# Altium project zPovBirthday.PrjPcb
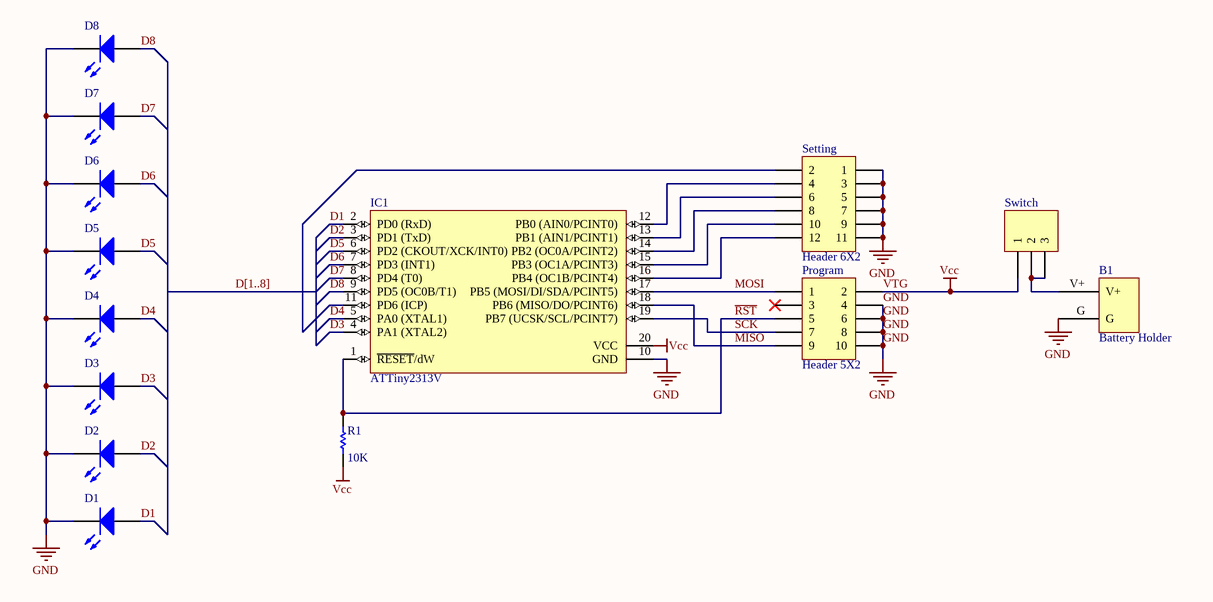
[diagram p0: main.SchDoc]
1 sheet, 14 parts. Net scope: global (net labels, ports and power ports of the same name join across sheets).

## Sheet main.SchDoc: POV
size A4

### Parts
B1  Battery Holder  [Battery Holder]
D1  LED1  [Led5mm]  (value not drawn)
D2  LED1  [Led5mm]  (value not drawn)
D3  LED1  [Led5mm]  (value not drawn)
D4  LED1  [Led5mm]  (value not drawn)
D5  LED1  [Led5mm]  (value not drawn)
D6  LED1  [Led5mm]  (value not drawn)
D7  LED1  [Led5mm]  (value not drawn)
D8  LED1  [Led5mm]  (value not drawn)
IC1  ATTiny2313V  [20P3]
Program  Header 5X2  [Box2x5]
R1  value 10K  [AXIAL-0.3]  (hidden comment: Res1)
Setting  Header 6X2  [DIP6SWITCH]
Switch  Header 3  [HDR1X3]  (value not drawn)

### Nets
GND: B1.G D1.2(K) D2.2(K) D3.2(K) D4.2(K) D5.2(K) D6.2(K) D7.2(K) D8.2(K) IC1.10(GND) Program.4 Program.6 Program.8 Program.10 Setting.1 Setting.3 Setting.5 Setting.7 Setting.9 Setting.11
VTG: IC1.20(VCC) Program.2 R1.1 Switch.1  [also labelled Vcc]
D1: D1.1(A) IC1.2(PD0_(RxD))
D2: D2.1(A) IC1.3(PD1_(TxD))
D3: D3.1(A) IC1.4(PA1_(XTAL2))
D4: D4.1(A) IC1.5(PA0_(XTAL1))
D5: D5.1(A) IC1.6(PD2_(CKOUT/XCK/INT0))
D6: D6.1(A) IC1.7(PD3_(INT1))
D7: D7.1(A) IC1.8(PD4_(T0))
D8: D8.1(A) IC1.9(PD5_(OC0B/T1))
MISO: IC1.18(PB6_(MISO/DO/PCINT6)) Program.9
MOSI: IC1.17(PB5_(MOSI/DI/SDA/PCINT5)) Program.1
~{RST}: IC1.1(~{RESET}/dW) Program.5 R1.2
SCK: IC1.19(PB7_(UCSK/SCL/PCINT7)) Program.7
NetB1_V+: B1.V+ Switch.2 Switch.3
NetIC1_11: IC1.11(PD6_(ICP)) Setting.2
NetIC1_12: IC1.12(PB0_(AIN0/PCINT0)) Setting.4
NetIC1_13: IC1.13(PB1_(AIN1/PCINT1)) Setting.6
NetIC1_14: IC1.14(PB2_(OC0A/PCINT2)) Setting.8
NetIC1_15: IC1.15(PB3_(OC1A/PCINT3)) Setting.10
NetIC1_16: IC1.16(PB4_(OC1B/PCINT4)) Setting.12

Not connected (* = marked no-connect by the designer): Program 3*

### Buses and harness runs
bus D[1..8]

### Library data of the parts
D1-D8 = LED1: Typical RED GaAs LED; Published: 8-Jun-2000; LatestRevisionDate: 08-Jul-2005; LatestRevisionNote: Mech Layer 1 removed.; PackageReference: LED-1; Publisher: Altium Limited
IC1 = ATtiny2313V-PI: 8-Bit AVR Microcontroller with 2K Bytes of Flash Memory; Published: 17-Sep-2003; LatestRevisionDate: 04-Mar-2005; LatestRevisionNote: Stylized 3D Model Added.; DatasheetVersion: 1477C-AVR-09/02; PackageVersion: Aug-1999; PackageReference: 20P3; Publisher: Altium Limited; PackageDescription: DIP; 20 Leads; Row Spacing 7.62 mm; Pitch 2.54 mm; Code_JEDEC: MS-001-AD; ComponentLink1Description: Manufacturer Link; ComponentLink1URL: http://www.atmel.com; ComponentLink2Description: Datasheet; ComponentLink2URL: http://www.atmel.com/dyn/resources/prod_documents/doc1477.pdf
Program = Header 5X2: Header, 5-Pin, Dual row; LatestRevisionDate: 17-Jul-2002; LatestRevisionNote: Re-released for DXP Platform.; Publisher: Altium Limited
R1 = Res1: Resistor; Published: 8-Jun-2000; LatestRevisionDate: 17-Jul-2002; LatestRevisionNote: Re-released for DXP Platform.; PackageReference: AXIAL-0.3; Publisher: Altium Limited
Setting = Header 6X2: Header, 6-Pin, Dual row; LatestRevisionDate: 17-Jul-2002; LatestRevisionNote: Re-released for DXP Platform.; Publisher: Altium Limited
Switch = Header 3: Header, 3-Pin; LatestRevisionDate: 17-Jul-2002; LatestRevisionNote: Re-released for DXP Platform.; Publisher: Altium Limited